# EAGLE design gog2 (EAGLE 6.2)
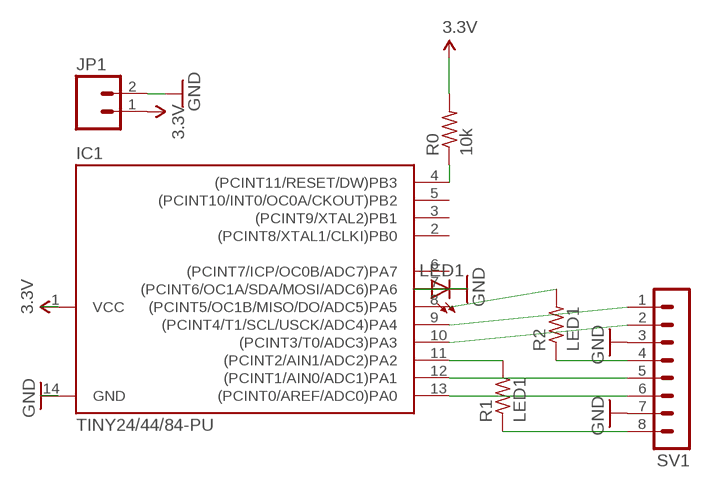
[diagram p0: schematic, sheet 1]

## Parts
IC1  TINY24/44/84-PU  [DIL14]
JP1  M02  [1X02_LONGPADS]
LED1  LED3MM  [LED3MM]
R0  10k  R-US_0207/7  [0207/7]
R1  LED1  R-US_0207/7  [0207/7]
R2  LED1  R-US_0207/7  [0207/7]
SV1  MA08-1  [MA08-1]

## Nets
3.3V: IC1.1(VCC) JP1.1 R0.2
GND: IC1.14(GND) JP1.2 LED1.K(C) SV1.3 SV1.7
MISO: IC1.8((PCINT5/OC1B/MISO/DO/ADC5)PA5) R2.2
N$1: IC1.7((PCINT6/OC1A/SDA/MOSI/ADC6)PA6) LED1.A
N$3: IC1.11((PCINT2/AIN1/ADC2)PA2) R1.2
N$4: R2.1 SV1.4
N$5: R1.1 SV1.8
N$6: IC1.13((PCINT0/AREF/ADC0)PA0) SV1.6
N$7: IC1.12((PCINT1/AIN0/ADC1)PA1) SV1.5
N$9: IC1.10((PCINT3/T0/ADC3)PA3) SV1.2
RESET: IC1.4((PCINT11/RESET/DW)PB3) R0.1
SCK: IC1.9((PCINT4/T1/SCL/USCK/ADC4)PA4) SV1.1
Unconnected: IC1.2((PCINT8/XTAL1/CLKI)PB0) IC1.3((PCINT9/XTAL2)PB1) IC1.5((PCINT10/INT0/OC0A/CKOUT)PB2) IC1.6((PCINT7/ICP/OC0B/ADC7)PA7)

## Library data of the parts
IC1 = avr-6:TINY24/44/84
JP1 = SparkFun:M02: Header 2 Standard 2-pin 0.1" header. Use with straight break away headers (SKU : PRT-00116), right angle break away headers (PRT-00553), swiss pins (PRT-00743), machine pins (PRT-00117), and female headers (PRT-00115). Molex polarized connector foot print use with SKU : PRT-08233 with associated crimp pins and housings.
LED1 = SparkFun:LED: LEDs Standard schematic elements and footprints for 5mm, 3mm, 1206, and 0603 sized LEDs. 5mm - Spark Fun Electronics SKU : COM-00529 (and others)
R0 R1 R2 = adafruit:R-US_: RESISTOR, American symbol
SV1 = con-lstb:MA08-1: PIN HEADER

## Board
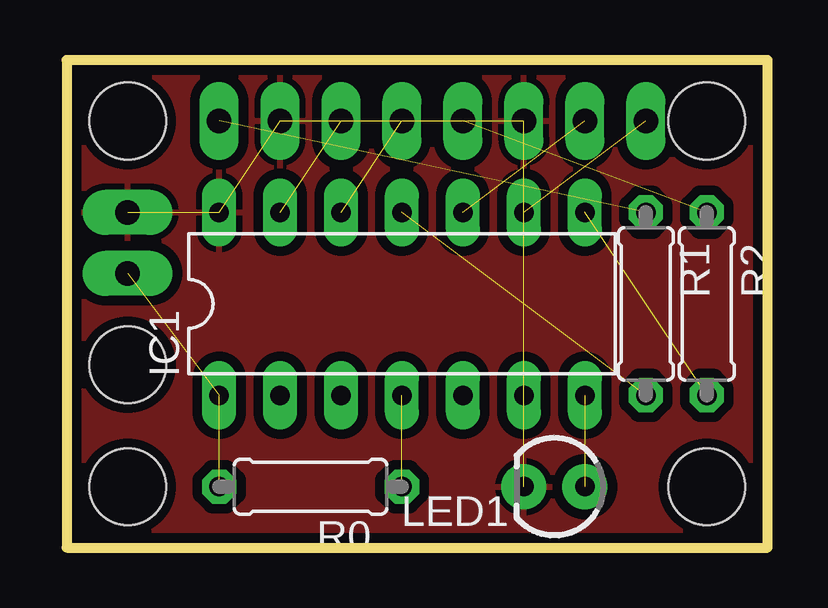
[diagram p1: board, top side]
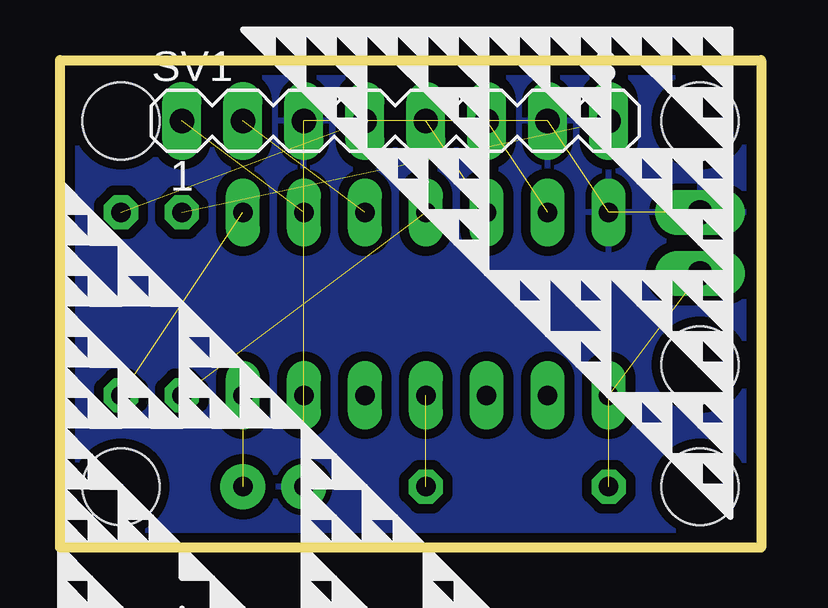
[diagram p2: board, bottom side, seen from below]

Size 29.21 x 20.32 mm. Coordinates in mm from the lower left corner, seen from the top.
Outline: 0,0 29.21,0 29.21,20.32 0,20.32 0,0
Copper layers (1*16): Top 0.035mm / dielectric 1.5mm / Bottom 0.035mm
Design rules: minimum track width 10mil, minimum drill 20mil, track to track 8mil, track to pad 8mil, pad to pad 8mil, via to via 8mil, smd to smd 8mil, copper to edge 10mil, drill to drill 8mil, minimum pad ring 12mil, minimum via ring 10mil, stop-mask expansion 4mil, vias tented up to drill 25mil, thermal gap 10mil
Holes 3.2 mm at 2.54,17.78 26.67,17.78 2.54,2.54 26.67,2.54 2.54,7.62

### Footprints (pad centres in the part's own frame; a part is rotated, then mirrored left to right if it is on the bottom)
DIL14 = drill 0.813 long: 1 -7.62,-3.81; 2 -5.08,-3.81; 3 -2.54,-3.81; 4 0,-3.81; 5 2.54,-3.81; 6 5.08,-3.81; 7 7.62,-3.81; 8 7.62,3.81; 9 5.08,3.81; 10 2.54,3.81; 11 0,3.81; 12 -2.54,3.81; 13 -5.08,3.81; 14 -7.62,3.81
1X02_LONGPADS = drill 1.016 pad 1.88 long: 1 0,0; 2 2.54,0
LED3MM = drill 0.813 pad 1.88: A -1.27,0; K 1.27,0
0207/7 = drill 0.813 octagon: 1 -3.81,0; 2 3.81,0
MA08-1 = drill 1.016 long: 1 -8.89,0; 2 -6.35,0; 3 -3.81,0; 4 -1.27,0; 5 1.27,0; 6 3.81,0; 7 6.35,0; 8 8.89,0

### Placement (x,y rotation side)
IC1  13.97,10.16 0 top
JP1  2.54,11.43 90 top
LED1  20.32,2.54 180 top
R0  10.16,2.54 180 top
R1  24.13,10.16 270 top
R2  26.67,10.16 270 top
SV1  15.24,17.78 0 bottom

### Tracks (layer width: path | path; a pad name or v marks a point on that pad's centre or on a via)
3.3V  (2 unrouted)
GND  (4 unrouted)
  pour Bottom (isolate 0.406): 0,0 0,20.32 29.21,20.32 29.21,0
  pour Top (isolate 0.406): 0,0 29.21,0 29.21,20.32 0,20.32
MISO  (1 unrouted)
N$1  (1 unrouted)
N$3  (1 unrouted)
N$4  (1 unrouted)
N$5  (1 unrouted)
N$6  (1 unrouted)
N$7  (1 unrouted)
N$9  (1 unrouted)
RESET  (1 unrouted)
SCK  (1 unrouted)